# Altium schematic sheet BaseModuleTop.SchDoc
size A
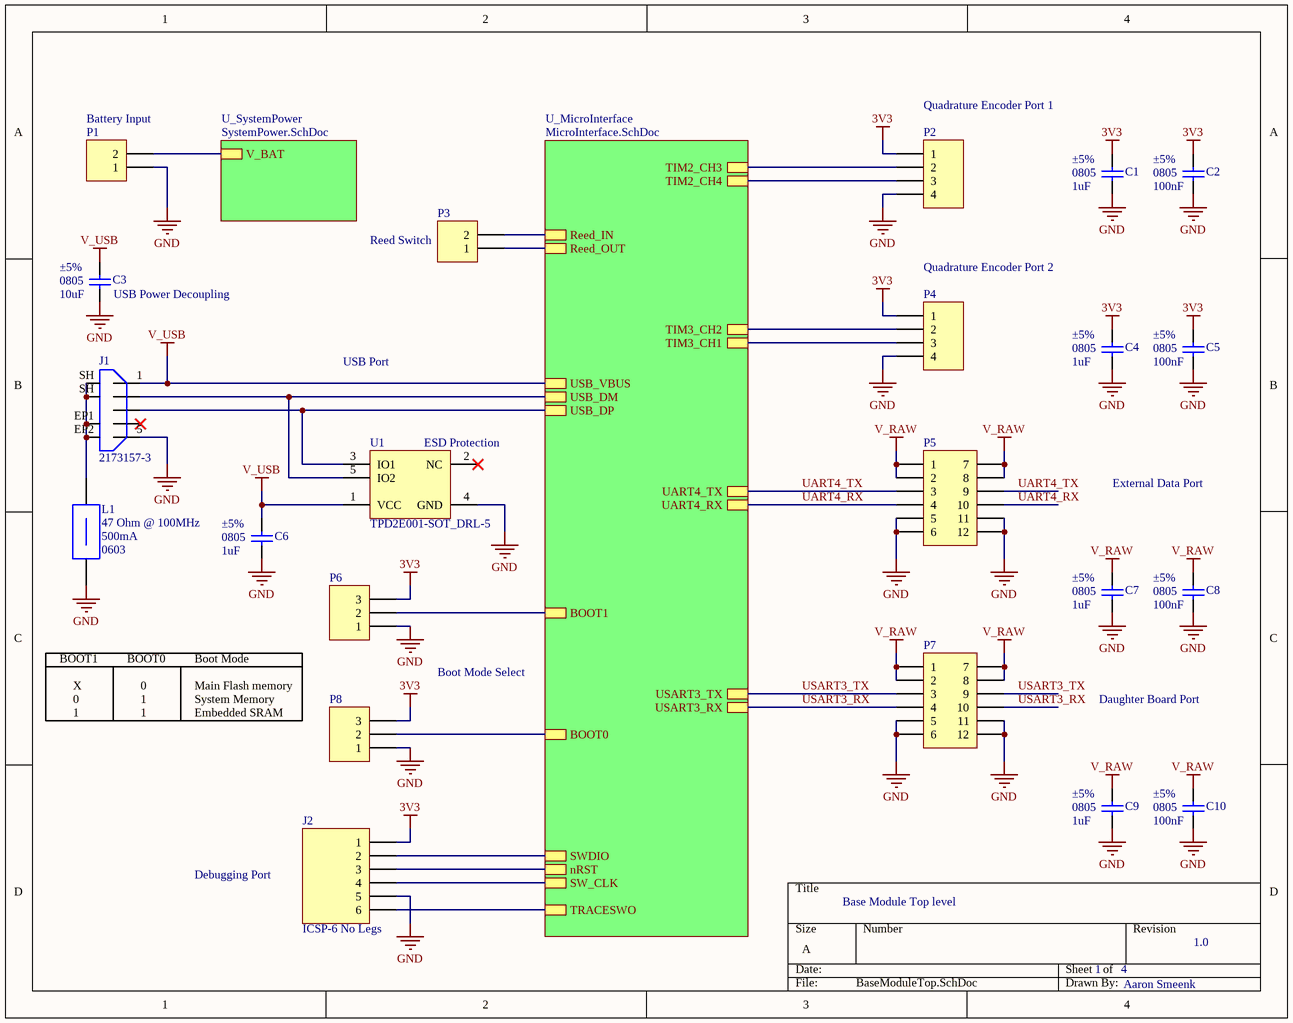
[diagram p0: BaseModuleTop.SchDoc]

## Parts
C1  value 1uF  Tolerance: ±5%  Case-EIA: 0805  [CAPC0805(2012)100_M]  (hidden comment: CAP 1uF 6.3V 0805(2012))
C2  value 100nF  Tolerance: ±5%  Case-EIA: 0805  [CAPC0805(2012)100_L]  (hidden comment: CAP 100nF 6.3V 0805(2012))
C3  value 10uF  Tolerance: ±5%  Case-EIA: 0805  [CAPC0805(2012)100_M]  (hidden comment: CAP 10uF 6.3V 0805(2012))
C4  value 1uF  Tolerance: ±5%  Case-EIA: 0805  [CAPC0805(2012)100_M]  (hidden comment: CAP 1uF 6.3V 0805(2012))
C5  value 100nF  Tolerance: ±5%  Case-EIA: 0805  [CAPC0805(2012)100_L]  (hidden comment: CAP 100nF 6.3V 0805(2012))
C6  value 1uF  Tolerance: ±5%  Case-EIA: 0805  [CAPC0805(2012)100_M]  (hidden comment: CAP 1uF 6.3V 0805(2012))
C7  value 1uF  Tolerance: ±5%  Case-EIA: 0805  [CAPC0805(2012)100_M]  (hidden comment: CAP 1uF 6.3V 0805(2012))
C8  value 100nF  Tolerance: ±5%  Case-EIA: 0805  [CAPC0805(2012)100_L]  (hidden comment: CAP 100nF 6.3V 0805(2012))
C9  value 1uF  Tolerance: ±5%  Case-EIA: 0805  [CAPC0805(2012)100_M]  (hidden comment: CAP 1uF 6.3V 0805(2012))
C10  value 100nF  Tolerance: ±5%  Case-EIA: 0805  [CAPC0805(2012)100_L]  (hidden comment: CAP 100nF 6.3V 0805(2012))
J1  2173157-3  [2173157-3]
J2  ICSP-6 No Legs  [TC2030-IDC-NL]
L1  Impedance @ Frequency: 47 Ohm @ 100MHz  Current Rating: 500mA  Package / Case: 0603  [LI0603E470R-10]  (hidden comment: LI0603E470R-10)
P1  Header 2  [HDR1X2]  (value not drawn)
P2  Header 4  [HDR1X4]  (value not drawn)
P3  Header 2  [HDR1X2]  (value not drawn)
P4  Header 4  [HDR1X4]  (value not drawn)
P5  Header 6X2A  [HDR2X6_CEN]  (value not drawn)
P6  Header 3  [HDR1X3]  (value not drawn)
P7  Header 6X2A  [HDR2X6_CEN]  (value not drawn)
P8  Header 3  [HDR1X3]  (value not drawn)
U1  TPD2E001-SOT_DRL-5  [TPD2E001DRLR]

## Sub-sheets
U_MicroInterface = MicroInterface.SchDoc: UART4_TX, UART4_RX, USART3_TX, USART3_RX, SWDIO, SW_CLK, TRACESWO, BOOT1, BOOT0, USB_DP, USB_DM, USB_VBUS, nRST, TIM3_CH1, TIM3_CH2, TIM2_CH4, TIM2_CH3, Reed_IN, Reed_OUT
U_SystemPower = SystemPower.SchDoc: V_BAT

## Nets
3V3: C1.2 C2.2 C4.2 C5.2 J2.1 P2.1 P4.1 P6.3 P8.3
GND: C1.1 C2.1 C3.1 C4.1 C5.1 C6.1 C7.1 C8.1 C9.1 C10.1 J1.5(GND) J2.5 L1.1 P1.1 P2.4 P4.4 P5.5 P5.6 P5.11 P5.12 P6.1 P7.5 P7.6 P7.11 P7.12 P8.1 U1.4(GND)
V_RAW: C7.2 C8.2 C9.2 C10.2 P5.1 P5.2 P5.7 P5.8 P7.1 P7.2 P7.7 P7.8
V_USB: C3.2 C6.2 J1.1(5V) U1.1(VCC) ; sheet U_MicroInterface/USB_VBUS
UART4_RX: P5.4 P5.10 ; sheet U_MicroInterface/UART4_RX
UART4_TX: P5.3 P5.9 ; sheet U_MicroInterface/UART4_TX
USART3_RX: P7.4 P7.10 ; sheet U_MicroInterface/USART3_RX
USART3_TX: P7.3 P7.9 ; sheet U_MicroInterface/USART3_TX
NetJ1_2: J1.2(D-) U1.5(IO2) ; sheet U_MicroInterface/USB_DM
NetJ1_3: J1.3(D+) U1.3(IO1) ; sheet U_MicroInterface/USB_DP
NetJ1_EP1: J1.EP1 J1.EP2 J1.SH L1.2
NetJ2_2: J2.2 ; sheet U_MicroInterface/SWDIO
NetJ2_3: J2.3 ; sheet U_MicroInterface/nRST
NetJ2_4: J2.4 ; sheet U_MicroInterface/SW_CLK
NetJ2_6: J2.6 ; sheet U_MicroInterface/TRACESWO
NetP1_2: P1.2 ; sheet U_SystemPower/V_BAT
NetP2_2: P2.2 ; sheet U_MicroInterface/TIM2_CH3
NetP2_3: P2.3 ; sheet U_MicroInterface/TIM2_CH4
NetP3_1: P3.1 ; sheet U_MicroInterface/Reed_OUT
NetP3_2: P3.2 ; sheet U_MicroInterface/Reed_IN
NetP4_2: P4.2 ; sheet U_MicroInterface/TIM3_CH2
NetP4_3: P4.3 ; sheet U_MicroInterface/TIM3_CH1
NetP6_2: P6.2 ; sheet U_MicroInterface/BOOT1
NetP8_2: P8.2 ; sheet U_MicroInterface/BOOT0

Not connected (* = marked no-connect by the designer): J1 4(ID)*; U1 2(NC)*

## Notes on the sheet
- (near P1) Battery Input
- (near P2) Quadrature Encoder Port 1
- (near C3) USB Power Decoupling
- (near P3) Reed Switch
- (near P4) Quadrature Encoder Port 2
- USB Port
- (near U1) ESD Protection
- External Data Port
- BOOT1
- X
- 0
- BOOT0
- 1
- Boot Mode
- Main Flash memory
- System Memory
- Boot Mode Select
- Daughter Board Port
- Embedded SRAM
- Debugging Port
- Base Module Top level
- 4
- 1.0
- Aaron Smeenk

## Library data of the parts
C1 C4 C6 C7 C9 = CMP-1036-04730-1: CAP 1uF 6.3V ±5% 0805 (2012 Metric) Thickness 1mm SMD; Case-Metric: 2012; Technology: SMT; Max Thickness: 1 mm; Rated Voltage: 6.3 V
C2 C5 C8 C10 = CMP-1036-04390-1: CAP 100nF 6.3V ±5% 0805 (2012 Metric) Thickness 1mm SMD; Case-Metric: 2012; Rated Voltage: 6.3 V; Technology: SMT; Max Thickness: 1 mm
C3 = CMP-1036-04730-1: CAP 10uF 6.3V ±5% 0805 (2012 Metric) Thickness 1mm SMD; Case-Metric: 2012; Technology: SMT; Max Thickness: 1 mm; Rated Voltage: 6.3 V
J1 = 2173157-3: USB Connectors SPLASH PROOF MICRO 5P USB B-TYPE; Number of Ports: 1; Number of Contacts: 5; Gender: Female; Brand: TE Connectivity; Mounting Angle: Right; Product: Micro USB Type B Connectors; Standard: USB 2.0; Termination Style: SMD; Contact Material: Copper Alloy; Contact Plating: Gold; Shell Plating: Tin
J2 = ICSP-6 No Legs: 6 Pin Connector
L1 = LI0603E470R-10: FERRITE CHIP 47 OHMS 500MA 0603; DC Resistance (DCR): 100 mOhm Max; Filter Type: Differential Mode - Single; Height (Max): 0.037" (0.95mm)
P1 P3 = Header 2: Header, 2-Pin; LatestRevisionDate: 17-Jul-2002; LatestRevisionNote: Re-released for DXP Platform.; Publisher: Altium Limited
P2 P4 = Header 4: Header, 4-Pin; LatestRevisionDate: 17-Jul-2002; LatestRevisionNote: Re-released for DXP Platform.; Publisher: Altium Limited
P5 P7 = Header 6X2A: Header, 6-Pin, Dual row; LatestRevisionDate: 17-Jul-2002; LatestRevisionNote: Re-released for DXP Platform.; Publisher: Altium Limited
P6 P8 = Header 3: Header, 3-Pin; LatestRevisionDate: 17-Jul-2002; LatestRevisionNote: Re-released for DXP Platform.; Publisher: Altium Limited
U1 = TPD2E001DRLR: TVS DIODE 5.5VWM 100VC SOT5; Bidirectional Channels: 2; Voltage - Reverse Standoff (Typ): 5.5V (Max); Voltage - Breakdown (Min): 11V; Voltage - Clamping (Max) @ Ipp: 100V; Power Line Protection: Yes; Type: Steering (Rail to Rail); Operating Temperature: -40°C ~ 85°C (TA); Package / Case: SOT-553; Supplier Device Package: 5-SOT